# EAGLE schematic STM32F4_PCB (EAGLE 6.1)
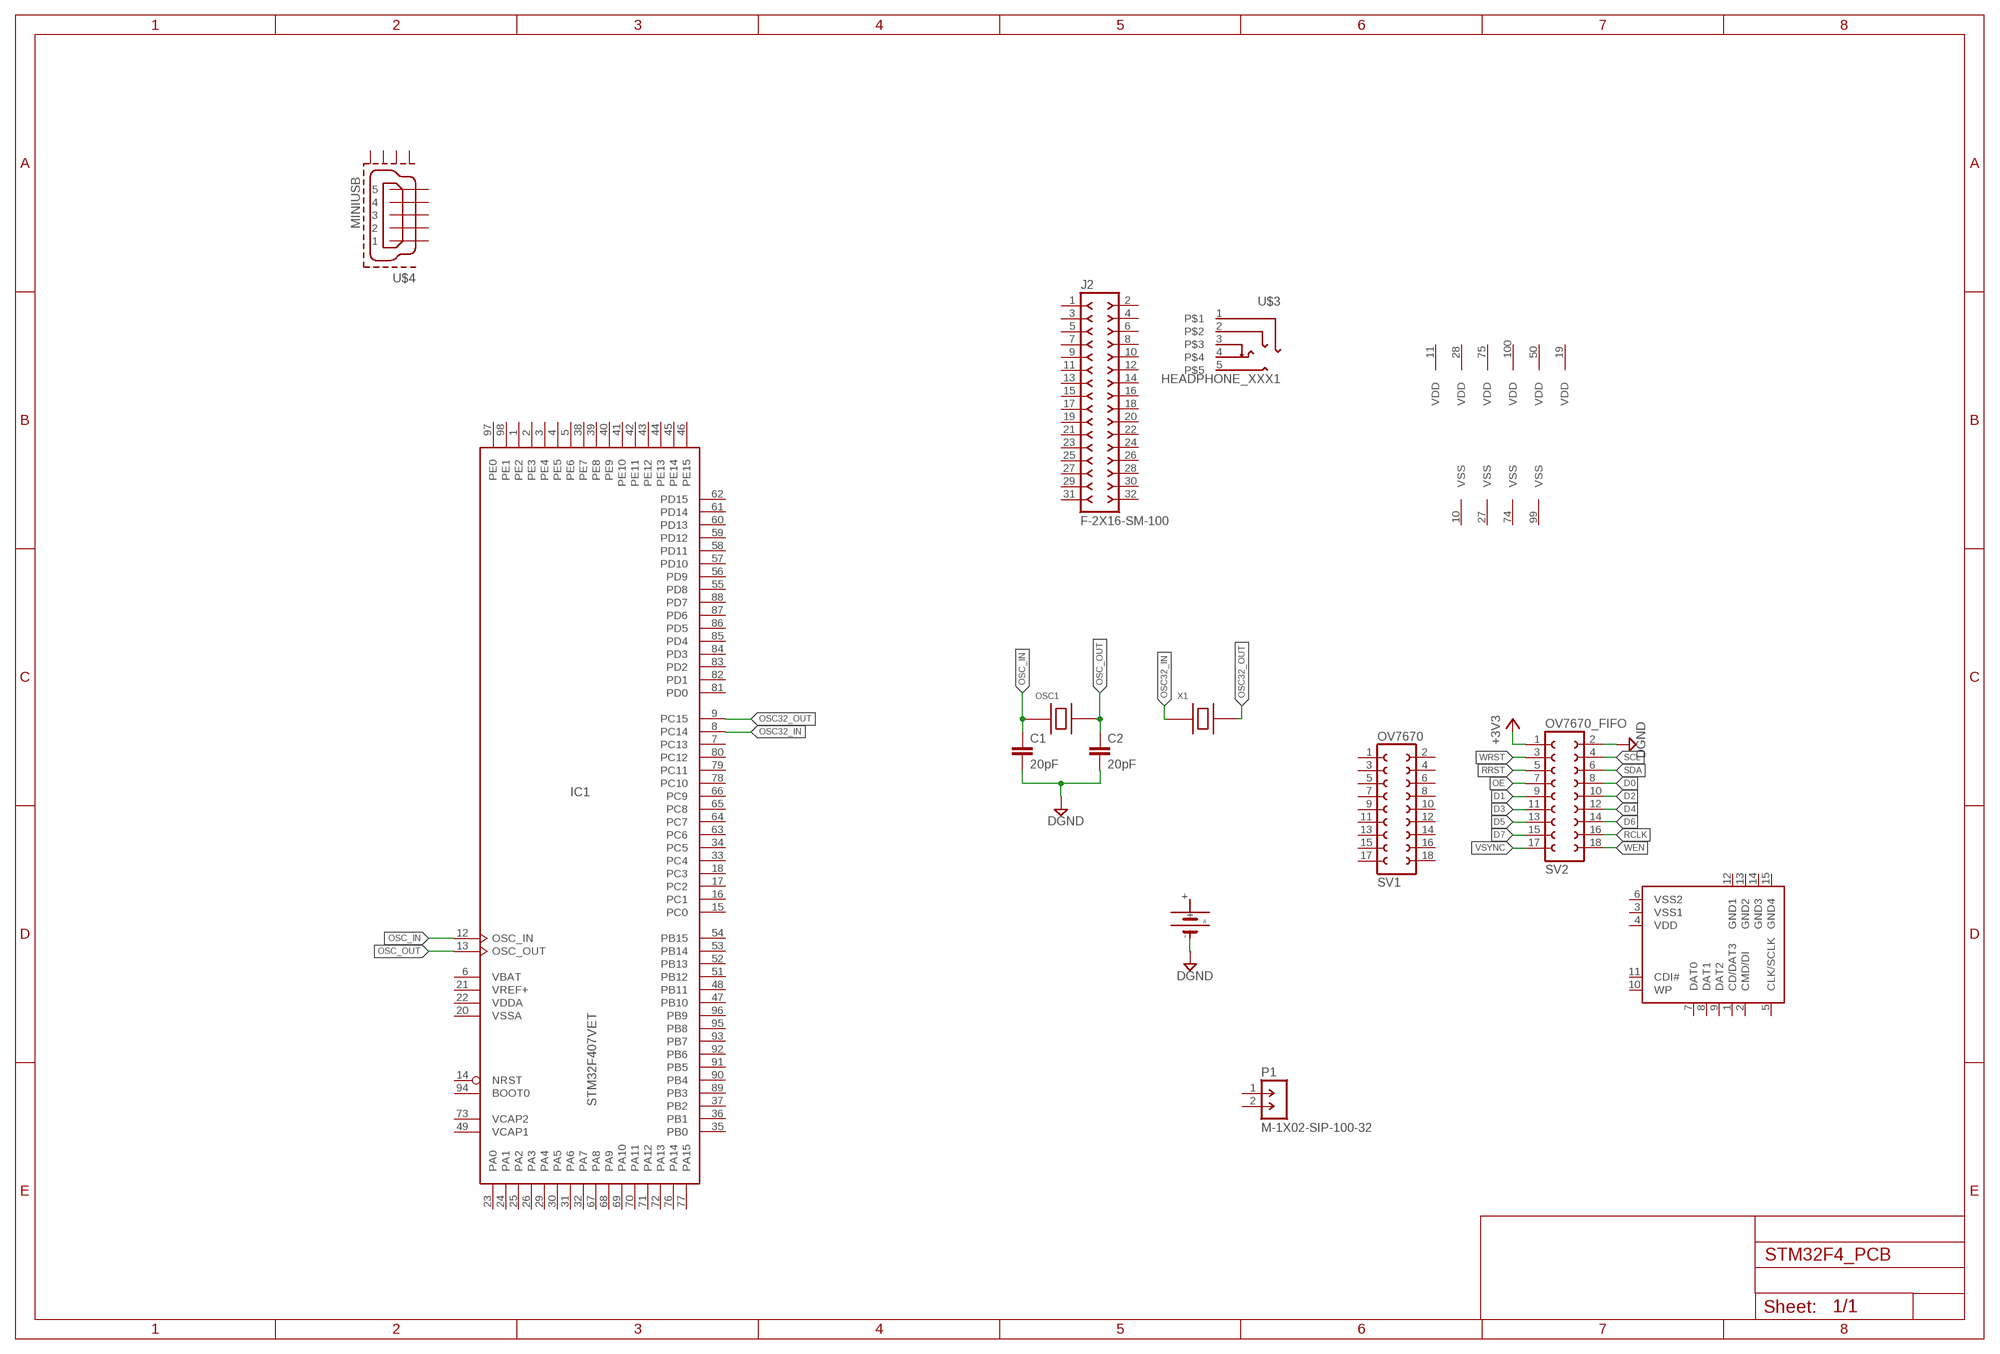
[diagram p0: schematic, sheet 1]

## Parts
C1  20pF  C-EUC1206  [C1206]
C2  20pF  C-EUC1206  [C1206]
IC1  STM32F407VET  [LQFP100]
J2  F-2X16-SM-100  [SF-100-2X8]
OSC1  8.0MHz  SMCE-7050  [IQG7050B]
P1  M-1X02-SIP-100-32  [SIP-100-02-32]
SV1  OV7670  FE09-2W  [FE09-2W]
SV2  OV7670_FIFO  FE09-2  [FE09-2]
U$1  1220BATTERY_SF  [1220BATTERY]
U$2  SDCARDVAR2  [SDCMF-10915W010]
U$3  HEADPHONE_XXX1  [HEADPHONE_XXX1]
U$4  MINIUSB  [MK5P]
X1  32.768kHz  SMAQ-5032A  [IQG5032A]

## Nets
+3V3: SV2.1
D0: SV2.8
D1: SV2.9
D2: SV2.10
D3: SV2.11
D4: SV2.12
D5: SV2.13
D6: SV2.14
D7: SV2.15
DGND: C1.2 C2.2 SV2.2 U$1.-
OE: SV2.7
OSC32_IN: IC1.8(PC14) X1.P$1(PIN1)
OSC32_OUT: IC1.9(PC15) X1.P$2(PIN2)
OSC_IN: C1.1 IC1.12(OSC_IN) OSC1.P$1(PIN1)
OSC_OUT: C2.1 IC1.13(OSC_OUT) OSC1.P$3(PIN2)
RCLK: SV2.16
RRST: SV2.5
SCL: SV2.4
SDA: SV2.6
VSYNC: SV2.17
WEN: SV2.18
WRST: SV2.3
Unconnected: IC1.1(PE2) IC1.2(PE3) IC1.3(PE4) IC1.4(PE5) IC1.5(PE6) IC1.7(PC13) IC1.14(NRST) IC1.15(PC0) IC1.16(PC1) IC1.17(PC2) IC1.18(PC3) IC1.23(PA0) IC1.24(PA1) IC1.25(PA2) IC1.26(PA3) IC1.29(PA4) IC1.30(PA5) IC1.31(PA6) IC1.32(PA7) IC1.33(PC4) IC1.34(PC5) IC1.35(PB0) IC1.36(PB1) IC1.37(PB2) IC1.38(PE7) IC1.39(PE8) IC1.40(PE9) IC1.41(PE10) IC1.42(PE11) IC1.43(PE12) IC1.44(PE13) IC1.45(PE14) IC1.46(PE15) IC1.47(PB10) IC1.48(PB11) IC1.51(PB12) IC1.52(PB13) IC1.53(PB14) IC1.54(PB15) IC1.55(PD8) IC1.56(PD9) IC1.57(PD10) IC1.58(PD11) IC1.59(PD12) IC1.60(PD13) IC1.61(PD14) IC1.62(PD15) IC1.63(PC6) IC1.64(PC7) IC1.65(PC8) IC1.66(PC9) IC1.67(PA8) IC1.68(PA9) IC1.69(PA10) IC1.70(PA11) IC1.71(PA12) IC1.72(PA13) IC1.76(PA14) IC1.77(PA15) IC1.78(PC10) IC1.79(PC11) IC1.80(PC12) IC1.81(PD0) IC1.82(PD1) IC1.83(PD2) IC1.84(PD3) IC1.85(PD4) IC1.86(PD5) IC1.87(PD6) IC1.88(PD7) IC1.89(PB3) IC1.90(PB4) IC1.91(PB5) IC1.92(PB6) IC1.93(PB7) IC1.94(BOOT0) IC1.95(PB8) IC1.96(PB9) IC1.97(PE0) IC1.98(PE1) J2.1 J2.2 J2.3 J2.4 J2.5 J2.6 J2.7 J2.8 J2.9 J2.10 J2.11 J2.12 J2.13 J2.14 J2.15 J2.16 J2.17 J2.18 J2.19 J2.20 J2.21 J2.22 J2.23 J2.24 J2.25 J2.26 J2.27 J2.28 J2.29 J2.30 J2.31 J2.32 P1.1 P1.2 SV1.1 SV1.2 SV1.3 SV1.4 SV1.5 SV1.6 SV1.7 SV1.8 SV1.9 SV1.10 SV1.11 SV1.12 SV1.13 SV1.14 SV1.15 SV1.16 SV1.17 SV1.18 U$1.+ U$2.1(CD/DAT3) U$2.2(CMD/DI) U$2.5(CLK/SCLK) U$2.7(DAT0) U$2.8(DAT1) U$2.9(DAT2) U$2.10(WP) U$2.11(CDI#) U$3.1 U$3.2 U$3.3 U$3.4 U$3.5 U$4.1 U$4.2 U$4.3 U$4.4 U$4.5 U$4.P$1(GND1) U$4.P$2(GND2) U$4.P$6(GND3) U$4.P$7(GND4)

## Power pins joined to a net without a drawn wire
GND1: U$2.12(GND1)
GND2: U$2.13(GND2)
GND3: U$2.14(GND3)
GND4: U$2.15(GND4)
VBAT: IC1.6(VBAT)
VCAP1: IC1.49(VCAP1)
VCAP2: IC1.73(VCAP2)
VDD: IC1.11(VDD) IC1.19(VDD) IC1.28(VDD) IC1.50(VDD) IC1.75(VDD) IC1.100(VDD) U$2.4(VDD)
VDDA: IC1.22(VDDA)
VREF+: IC1.21(VREF+)
VSS: IC1.10(VSS) IC1.27(VSS) IC1.74(VSS) IC1.99(VSS)
VSS1: U$2.3(VSS1)
VSS2: U$2.6(VSS2)
VSSA: IC1.20(VSSA)

## Library data of the parts
C1 C2 = resistor:C-EU: CAPACITOR, European symbol
IC1 = micro-stm:STM32F407V*T: ARM 32-bit Cortex™-M3 CPU 168 MHz maximum frequency 512 to 1024 Kbytes of Flash memory 192 kbytes of SRAM 82 GPIOs 1.8 to 3.6 V application supply
J2 = con-headers-jp:F-2X16-: FEMALE HEADER
OSC1 = osc:SMCE-7050: Seam Welded Seal SMD Package SMCE-7050 4 Pads Pb-Free, RoHs Compliant Company Website:http://www.interquip.com/
P1 = con-headers-jp:M-1X02-: MALE HEADER
SV1 = con-lsta:FE09-2W: FEMALE HEADER; OC_FARNELL: unknown; OC_NEWARK: unknown
SV2 = con-lsta:FE09-2: FEMALE HEADER; OC_FARNELL: unknown; OC_NEWARK: unknown
U$1 = battery2:1220BATTERY_SF
U$2 = kingfont_sdcmf10915w010_covek:SDCARD: SD card connector KINGFONT SDCMF-10915W010
U$3 = 2ref-packages-longpad:HEADPHONE_XXX1
U$4 = usb_con-update:MINIUSB
X1 = osc:SMAQ-5032A: All Quartz SMD Package SMAQ-5032A 2Pads Pb-Free, RoHs Compliant Company Website:http://www.interquip.com/